# EasyEDA Pro project MSDRV4.eprj, board MAX2831_2024_REUSE
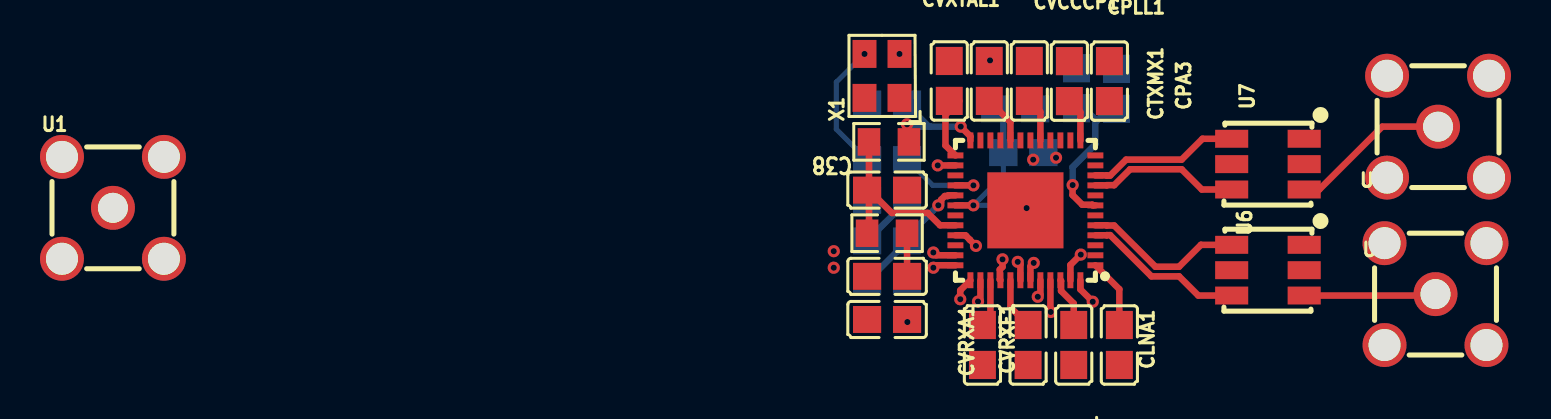
[diagram p8: board, top side]
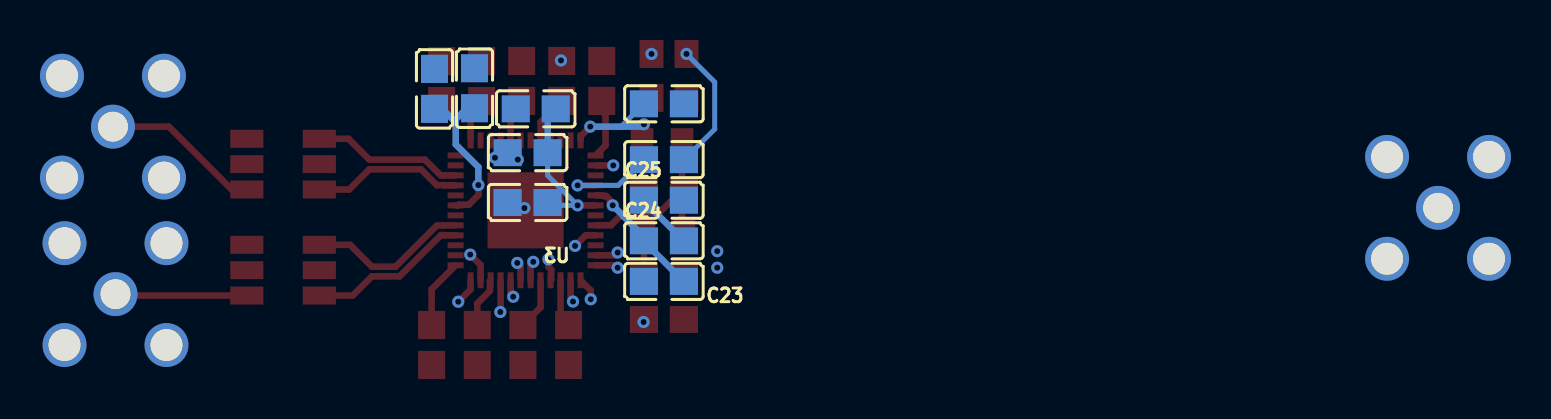
[diagram p9: board, bottom side, seen from below]

No outline. copper layers: Top Layer, Inner1, Inner2, Inner3, Inner4, Bottom Layer. Coordinates in mm from the lowest, leftmost part position.
Stack: Top Layer 0.035mm Outer layer thickness 1oz / Dielectric1 0.0994mm 3313 RC57% 4.2mil / Inner1 0.0152mm Inner layer thickness / Dielectric2 0.55mm 0.55mm H/H No copper / Inner2 0.0152mm Inner layer thickness / Dielectric3 0.1088mm 2116 RC54% 4.9mil / Inner3 0.0152mm Inner layer thickness / Dielectric4 0.55mm 0.55mm H/H No copper / Inner4 0.0152mm Inner layer thickness / Dielectric5 0.0994mm 3313 RC57% 4.2mil / Bottom Layer 0.035mm Outer layer thickness 1oz

## Design rules (mm)
net RXQN: RXQ
net RXQP: RXQ
net RXIN: RXI
net RXIP: RXI
net TXQN: TXQ
net TXQP: TXQ
net TXIN: TXI
net TXIP: TXI
template: JLCPCB Capability(Two Layers Board)
spacing copperThickness1oz (default): track to track 0.102, other pairs 0.152 to 0.3
spacing copperThickness2oz: track to track 0.203, other pairs 0.152 to 0.3
track width copperThickness1oz (default): min 0.127, default 0.254, max 2.54
track width copperThickness2oz: min 0.203, default 0.254, max 2.54
differential pair differentialPair (default): width min 0.127, default 0.254, max 2.54; gap min 0.152, default 0.152
via viaSize (default): diameter min 0.5, default 0.61, max 10; hole min 0.3, default 0.305, max 6.3

## Placement (name value [footprint] x y rotation side)
C18  100nF  [C0805]  38.72 1.28 0 top
C19  1nF  [C0805]  38.72 9.28 0 bottom
C20  100pF  [C0805]  38.72 12.07 0 bottom
C21  2200pF  [C0805]  38.72 3.44 0 top
C22  68pF  [C0805]  38.72 7.75 180 top
C23  18pF  [C0805]  38.72 3.18 0 bottom
C24  100nF  [C0805]  38.72 5.21 180 bottom
C25  100nF  [C0805]  38.72 7.25 180 bottom
CLNA1  100pF  [C0805]  50.34 0 270 top
CPA1  10uF  [C0805]  48.2 12.85 90 bottom
CPA2  10uF  [C0805]  50.2 12.82 90 bottom
CPA3  100nF  [C0805]  49.84 13.21 90 top
CPLL1  100pF  [C0805]  45.84 13.22 90 top
CRXMX1  100pF  [C0805]  48.06 0 270 top
CTXMX1  100pF  [C0805]  47.84 13.21 90 top
CVCCCP1  10nF  [C0805]  43.83 13.22 90 top
CVCO0  100pF  [C0805]  45.54 9.63 0 bottom
CVCO1  100pF  [C0805]  45.54 7.13 0 bottom
CVCO2  100pF  [C0805]  45.13 11.82 0 bottom
CVRXA1  100pF  [C0805]  43.49 0 270 top
CVRXF1  100pF  [C0805]  45.77 0 270 top
CVXTAL1  100pF  [C0805]  41.83 13.22 90 top
U1  MCX5.08-H5  [SMA-TH_MCX5.08-H5]  0 6.86 0 top
U3  MAX2831ETM+T  [TQFN-48_L7.0-W7.0-P0.50-TL-EP5.6]  45.64 6.74 180 top
U4  MCX5.08-H5  [SMA-TH_MCX5.08-H5]  66.15 2.55 0 top
U5  MCX5.08-H5  [SMA-TH_MCX5.08-H5]  66.28 10.93 0 top
U6  TCM2-43X+  [IND-SMD_6P-L4.1-W3.8-P1.27-TL]  57.77 3.74 270 top
U7  TCM2-43X+  [IND-SMD_6P-L4.1-W3.8-P1.27-TL]  57.77 9.05 270 top
U8  1.2K  [R0805]  38.72 5.59 0 top
U9  750  [R0805]  38.82 10.17 0 top
X1  40MHz  [OSC-SMD_4P-L3.2-W2.5-BL]  38.47 13.47 90 top

## Footprints (pads in the part's own frame, mm; a bottom-side part is the same pattern mirrored in y, then rotated)
C0805
  rect 1.41x1.35 smd: 1(-1,0) 2(1,0)
IND-SMD_6P-L4.1-W3.8-P1.27-TL
  rect 0.9x1.657 smd: 1(-1.27,1.813) 2(0,1.813) 3(1.27,1.813) 4(1.27,-1.813) 5(0,-1.813) 6(-1.27,-1.813)
OSC-SMD_4P-L3.2-W2.5-BL
  rect 1.4x1.2 smd: 1(-1.1,-0.875) 2(1.1,-0.875) 3(1.1,0.875) 4(-1.1,0.875)
R0805
  rect 1.133x1.377 smd: 1(-1,0) 2(1,0)
SMA-TH_MCX5.08-H5
  round 2.2 hole 1.6: 1(-2.55,-2.55) 2(-2.55,2.55) 3(2.55,2.55) 4(2.55,-2.55)
  round 2.2 hole 1.5: 5(0,0)
TQFN-48_L7.0-W7.0-P0.50-TL-EP5.6
  rect 0.8x0.3 smd: 1(-3.5,2.751) 2(-3.5,2.251) 3(-3.5,1.75) 4(-3.5,1.251) 5(-3.5,0.75) 6(-3.5,0.252) 7(-3.5,-0.249) 8(-3.5,-0.75) 9(-3.5,-1.25) 10(-3.5,-1.75) 11(-3.5,-2.249) 12(-3.5,-2.748) 25(3.5,-2.748) 26(3.5,-2.249) 27(3.5,-1.75) 28(3.5,-1.25) 29(3.5,-0.75) 30(3.5,-0.249) 31(3.5,0.252) 32(3.5,0.75) 33(3.5,1.251) 34(3.5,1.75) 35(3.5,2.251) 36(3.5,2.751)
  rect 0.3x0.8 smd: 13(-2.751,-3.5) 14(-2.251,-3.5) 15(-1.75,-3.5) 16(-1.25,-3.5) 17(-0.75,-3.5) 18(-0.251,-3.5) 19(0.249,-3.5) 20(0.75,-3.5) 21(1.25,-3.5) 22(1.75,-3.5) 23(2.251,-3.5) 24(2.751,-3.5) 37(2.751,3.5) 38(2.251,3.5) 39(1.75,3.5) 40(1.25,3.5) 41(0.75,3.5) 42(0.251,3.5) 43(-0.251,3.5) 44(-0.75,3.5) 45(-1.25,3.5) 46(-1.75,3.5) 47(-2.251,3.5) 48(-2.751,3.5)
  rect 3.81x3.81 smd: 49(0,0.001)

## Nets
+5V: X1.4
GND: C18.1 C20.1 C21.1 C22.1 C23.2 CLNA1.2 CPA1.2 CPA2.2 CPA3.2 CPLL1.2 CRXMX1.2 CTXMX1.2 CVCCCP1.2 CVCO0.2 CVCO1.2 CVCO2.2 CVRXA1.2 CVRXF1.2 CVXTAL1.2 U1.1 U1.2 U1.3 U1.4 U3.2 U3.26 U3.31 U3.47 U3.49 U4.1 U4.2 U4.3 U4.4 U5.1 U5.2 U5.3 U5.4 U6.1 U6.2 U7.1 U7.2 X1.2
3.3: CLNA1.1 CPA1.1 CPA2.1 CPA3.1 CPLL1.1 CRXMX1.1 CTXMX1.1 CVCCCP1.1 CVCO0.1 CVCO1.1 CVCO2.1 CVRXA1.1 CVRXF1.1 CVXTAL1.1 U3.1 U3.7 U3.13 U3.17 U3.20 U3.25 U3.27 U3.30 U3.39 U3.41 U3.46
$1I297\$1N1513: U4.5 U6.3
$1I297\$1N1514: U5.5 U7.3
$1I297\$1N1515: C21.2 U8.2
$1I297\$1N2254: C23.1 C24.1 U3.29
$1I297\$1N2490: C19.1 X1.3
$1I297\$1N3884: C25.2
$1I297\BYPASS: C18.2 U3.33
$1I297\CLKBUF: U3.21
$1I297\CPOUT: C20.2 U3.24 U9.2
$1I297\CS#: U3.15
$1I297\D1: U3.23
$1I297\D2: U3.11
$1I297\D3: U3.8
$1I297\D4: U3.34
$1I297\D5: U3.14
$1I297\D6: U3.3
$1I297\D7: U3.6
$1I297\DIN: U3.19
$1I297\PLL_LOCK: U3.22
$1I297\RSSI: U3.16
$1I297\RXHP: U3.40
$1I297\RXN: U3.5 U6.6
$1I297\RXP: U3.4 U6.4
$1I297\RXTX_MODE: U3.48
$1I297\SCLK: U3.18
$1I297\SHDN#: U3.12 X1.1
$1I297\TUNE: C22.2 U3.32 U8.1 U9.1
$1I297\TXN: U3.10 U7.6
$1I297\TXP: U3.9 U7.4
$1I297\XTAL: C19.2 C24.2 C25.1 U3.28
REF: U1.5
RXIN: U3.37
RXIP: U3.38
RXQN: U3.35
RXQP: U3.36
TXIN: U3.44
TXIP: U3.45
TXQN: U3.42
TXQP: U3.43

Pads without a net: U6 5; U7 5

## Via types
v1: diameter 0.61, hole 0.305, Top Layer to Bottom Layer, 28 vias

## Routing (per net, layer and track width the routed paths; a pad name or vN(x,y) marks a point on that pad's centre or on a via; arc(x,y) is an arc through that point)
GND: length 2.4
  Top Layer w0.33: v1(48.41,4.52) 47.89,4 U3.47 ; U3.26 v1(41.26,8.99)
  vias: v1(39.34,14.57) v1(43.87,14.24) v1(45.7,6.85) v1(46.03,9.28) v1(47.17,9.37)
3.3: length 37.6
  Top Layer w0.33: CVRXA1.1 43.89,1.4 U3.39 ; U3.1 50.34,2.79 CLNA1.1 ; CVCCCP1.1 44.89,11.16 U3.20 ; U3.41 44.89,1.88 CVRXF1.1 ; U3.13 48.39,11.65 CTXMX1.1 ; 42.34,12.22 41.64,11.52 41.64,9.99 U3.25 ; U3.46 47.42,3.21 47.42,2.71 48.06,2.08 CRXMX1.1 ; U3.30 v1(43.04,6.99) ; v1(48,8) 48,8 48,7.51 48.48,7.02 48.98,7.02 49.01,6.99 U3.7 ; CPLL1.1 46.39,11.66 U3.17
  Bottom Layer w0.254: CVCO1.1 44.39,6.99 v1(43.04,6.99) 44.54,8.49 CVCO0.1
  Bottom Layer w0.33: 49.14,11.14 49.14,10.04 48,8.91 v1(48,8) ; 49.14,11.14 50.2,12.2 ; 49.14,11.14 49.14,11.29 48.2,12.23 ; CVCO2.1 44.54,11.41 CVCO0.1
$1I297\$1N1513: length 6.6
  Top Layer w0.33: U4.5 66.08,2.47 U6.3
$1I297\$1N1514: length 8
  Top Layer w0.33: U5.5 63.49,10.93 60.34,7.78 U7.3
$1I297\$1N1515: length 2.2
  Top Layer w0.33: U8.2 C21.2
$1I297\$1N2254: length 6.4
  Top Layer w0.33: U3.29 41.78,7.49 41.75,7.46 41.61,7.46 41.42,7.27 41.42,7.13 v1(41.28,6.99)
  Bottom Layer w0.33: v1(41.28,6.99) 40.74,6.45 40.74,6.44 39.72,5.42 C24.1 39.72,5.18 C23.1
$1I297\$1N2490: length 6.5
  Bottom Layer w0.254: C19.1 37.71,9.28 36.18,10.8 36.18,13.16 v1(37.59,14.57)
$1I297\BYPASS: length 7.1
  Top Layer w0.33: v1(43.17,4.96) 42.86,5.27 42.86,5.27 42.67,5.46 42.67,5.46 42.64,5.49 U3.33 ; C18.2 39.72,1.17 v1(39.74,1.15)
  Inner4 w0.33: v1(43.17,4.96) 43.13,4.96 41.12,2.95 40.4,2.95 39.74,2.29 v1(39.74,1.15)
$1I297\CPOUT: length 6.2
  Top Layer w0.33: U3.24 42.89,10.44 v1(42.4,10.93) ; v1(39.72,11.05) 39.72,10.26 U9.2
  Bottom Layer w0.254: 40.86,10.93 C20.2
  Bottom Layer w0.33: v1(39.72,11.05) 39.84,10.93 v1(42.4,10.93)
$1I297\RXHP: length 1.1
  Top Layer w0.33: v1(44.5,4.29) 44.5,3.91 44.36,3.77 44.36,3.27 44.39,3.24
$1I297\RXN: length 8.1
  Top Layer w0.33: U3.5 49.71,5.99 49.71,5.98 50.08,5.98 52.14,3.92 53.33,3.92 54.42,5.01 U6.6
$1I297\RXP: length 8.1
  Top Layer w0.33: U3.4 49.71,5.49 49.71,5.5 49.88,5.5 51.94,3.44 53.33,3.44 54.29,2.47 U6.4
$1I297\RXTX_MODE: length 1.3
  Top Layer w0.33: U3.48 48.39,2.78 v1(49.01,2.17)
$1I297\TUNE: length 9.7
  Top Layer w0.33: 37.82,7.75 37.82,5.69 U8.1 ; 37.82,7.75 U9.1 ; 37.82,7.75 38.96,6.61 40.75,6.61 41.37,5.99 U3.32
$1I297\TXN: length 7.6
  Top Layer w0.33: U3.10 49.71,8.49 49.71,8.48 49.88,8.48 50.68,9.28 53.45,9.28 54.5,10.32 U7.6
$1I297\TXP: length 7.6
  Top Layer w0.33: 49.14,7.99 49.71,7.99 49.71,8 50.08,8 50.88,8.8 53.45,8.8 54.47,7.78 U7.4
$1I297\XTAL: length 7.6
  Top Layer w0.33: v1(43.04,7.99) 42.14,7.99
  Bottom Layer w0.254: v1(43.04,7.99) 41.01,7.99 C19.2
  Bottom Layer w0.33: C25.1 39.72,7.21 C24.2
RXIN: length 5.2
  Top Layer w0.33: U3.37 42.38,2.73 v1(42.38,2.29)
  Inner3 w0.33: 40.82,5.72 41.66,4.89 41.66,4.38 42.38,3.66 v1(42.38,2.29)
RXIP: length 5.9
  Top Layer w0.33: U3.38 43.39,2.3
  Inner3 w0.33: 41,6.23 42.14,5.09 42.14,4.58 43.07,3.66 43.07,3.01 43.27,2.81 v1(43.27,2.17)
RXQN: length 7.2
  Top Layer w0.33: U3.35 41.18,4.49 v1(41.04,4.63)
  Inner2 w0.33: v1(36.05,4.69) 35.42,4.69 35.28,4.56 35.35,4.56
  Inner3 w0.33: v1(41.04,4.63) 40.4,4.63 40.26,4.49 36.26,4.49 v1(36.05,4.69)
RXQP: length 7.2
  Top Layer w0.33: v1(41.04,3.87) 41.16,3.99 U3.36
  Inner2 w0.33: 35.35,4.07 35.28,4.07 35.48,3.87 v1(36.05,3.87)
  Inner3 w0.33: v1(41.04,3.87) 40.4,3.87 40.26,4.01 36.19,4.01 v1(36.05,3.87)
TXIN: length 11.4
  Top Layer w0.33: U3.44 46.39,2.54 v1(46.26,2.41)
  Inner2 w0.33: v1(46.26,2.41) 47.29,3.45 47.29,6.5 45.62,8.17 44.16,8.17 42.65,9.69
TXIP: length 13.4
  Top Layer w0.33: U3.45 46.89,1.67 v1(46.91,1.65)
  Inner2 w0.33: 42.85,10.17 44.36,8.66 45.82,8.66 47.79,6.68 47.79,2.9 47.36,2.46 47.36,2.1 v1(46.91,1.65)
TXQN: length 9.3
  Top Layer w0.33: v1(45.26,4.16) 45.39,4.03 U3.42
  Inner2 w0.33: v1(45.26,4.16) 45.26,4.8 45.42,4.95 45.42,5.28 44.95,5.75 40.11,5.75 38.97,6.89
TXQP: length 10
  Top Layer w0.33: v1(46.06,4.11) 45.89,3.94 U3.43
  Inner2 w0.33: v1(46.06,4.11) 46.14,4.19 46.14,4.66 45.98,4.82 45.98,5.4 45.15,6.23 40.31,6.23 39.13,7.41

## Text on the board
Top Silkscreen Layer: C38
